# EasyEDA Pro project RP2040_AWG.eprj

# Schematic Schematic1
Board Name: Board1; Create Date: 2025-03-31; Page Name: P1; Project Name: PICO2040AWG; Schematic Name: Schematic1; Update Date: 2025-04-02; Company: 嘉立创EDA; Page Size: A4; Version: V1.0
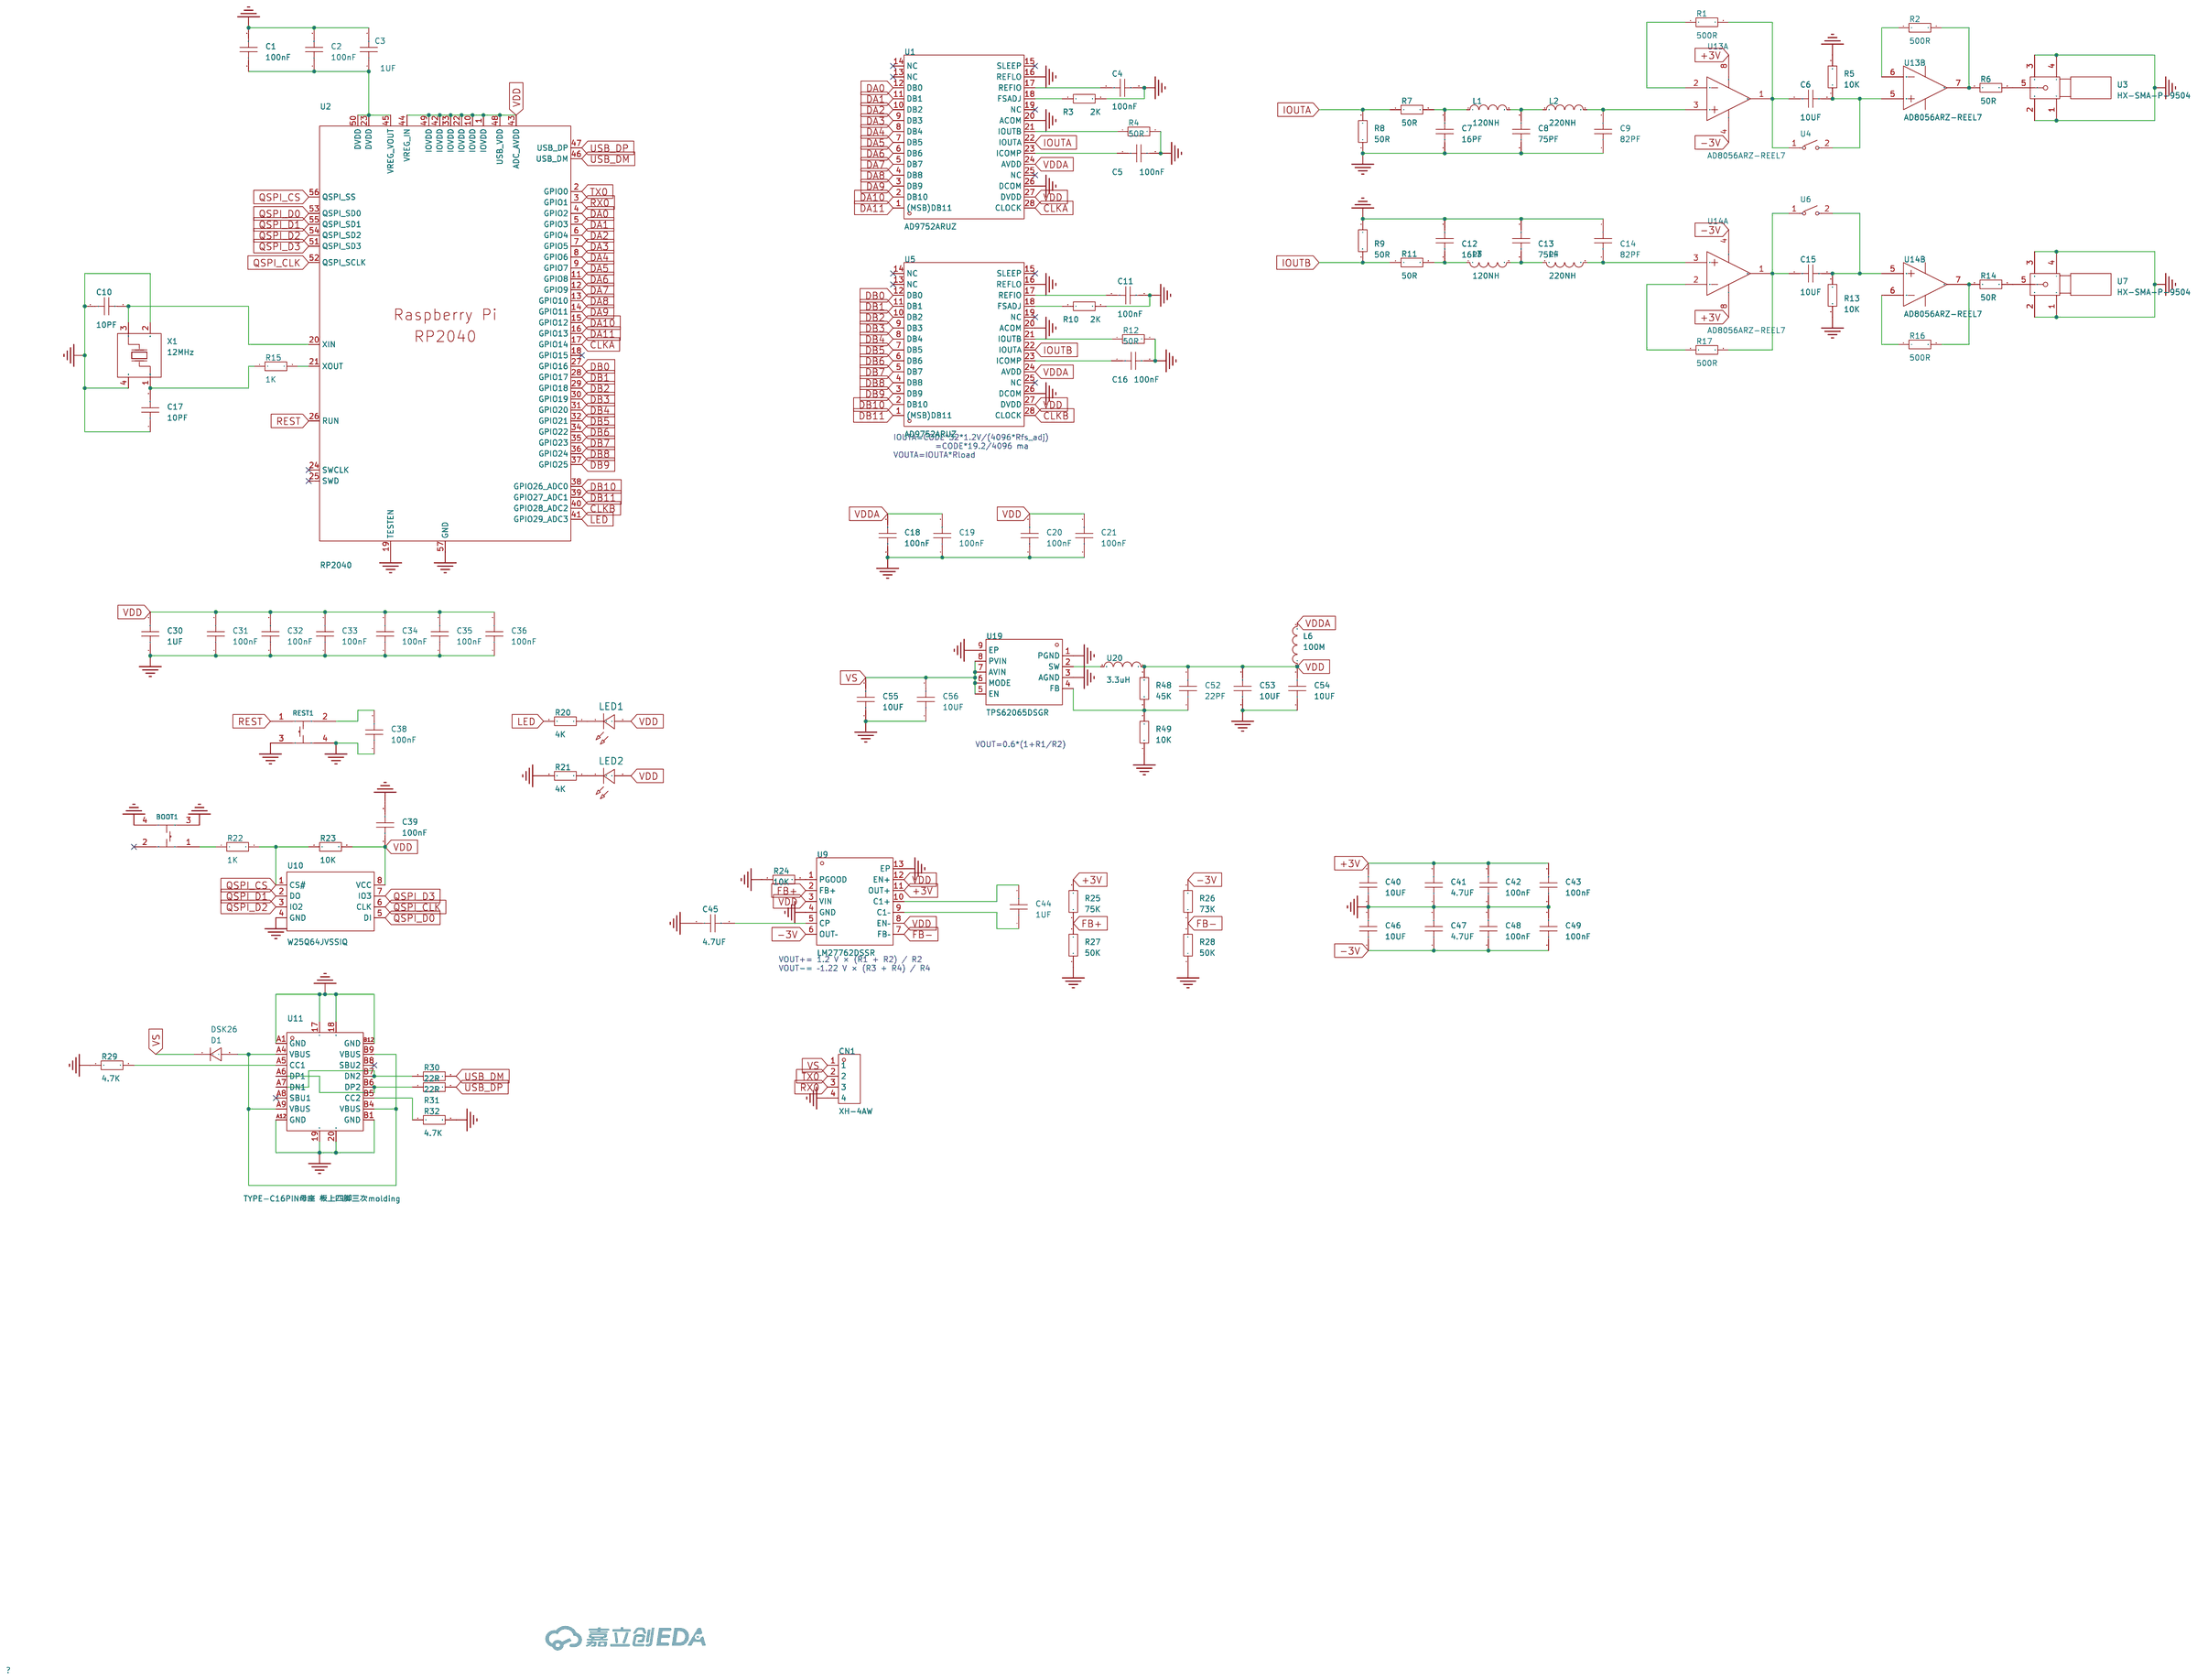
[diagram p0: schematic sheet]

## Parts
BOOT1  SKRPACE010  [KEY-SMD_4P-L4.2-W3.2-P2.20-LS4.6]
C1  100nF  [C0402_L]
C2  100nF  [C0402_L]
C3  1UF  [C0402_L]
C4  100nF  [C0402_L]
C5  100nF  [C0402_L]
C6  10UF  [C 0603_L]
C7  16PF  [C 0603_L]
C8  75PF  [C 0603_L]
C9  82PF  [C 0603_L]
C10  10PF  [C0402_L]
C11  100nF  [C0402_L]
C12  16PF  [C 0603_L]
C13  75PF  [C 0603_L]
C14  82PF  [C 0603_L]
C15  10UF  [C 0603_L]
C16  100nF  [C0402_L]
C17  10PF  [C0402_L]
C18  100nF  [C0402_L]
C19  100nF  [C0402_L]
C20  100nF  [C0402_L]
C21  100nF  [C0402_L]
C30  1UF  [C0402_L]
C31  100nF  [C0402_L]
C32  100nF  [C0402_L]
C33  100nF  [C0402_L]
C34  100nF  [C0402_L]
C35  100nF  [C0402_L]
C36  100nF  [C0402_L]
C38  100nF  [C0402_L]
C39  100nF  [C0402_L]
C40  10UF  [C0402_L]
C41  4.7UF  [C0402_L]
C42  100nF  [C0402_L]
C43  100nF  [C0402_L]
C44  1UF  [C0402_L]
C45  4.7UF  [C0402_L]
C46  10UF  [C0402_L]
C47  4.7UF  [C0402_L]
C48  100nF  [C0402_L]
C49  100nF  [C0402_L]
C52  22PF  [C0402_L]
C53  10UF  [C0402_L]
C54  10UF  [C0402_L]
C55  10UF  [C0402_L]
C56  10UF  [C0402_L]
CN1  XH-4AW  [CONN-TH_XH-4AW]
D1  DSK26  [SOD-123_L2.8-W1.8-LS3.7-RD]
L1  120NH  [L0603]
L2  220NH  [L0603]
L3  120NH  [L0603]
L4  220NH  [L0603]
L6  100M  [L0805]
LED1  -  [LED_0603]
LED2  -  [LED_0603]
R1  500R  [R0603_L]
R2  500R  [R0603_L]
R3  2K  [R0603_L]
R4  50R  [R0603_L]
R5  10K  [R0603_L]
R6  50R  [R0603_L]
R7  50R  [R0603_L]
R8  50R  [R0603_L]
R9  50R  [R0603_L]
R10  2K  [R0603_L]
R11  50R  [R0603_L]
R12  50R  [R0603_L]
R13  10K  [R0603_L]
R14  50R  [R0603_L]
R15  1K  [R0603_L]
R16  500R  [R0603_L]
R17  500R  [R0603_L]
R20  4K  [R0603_L]
R21  4K  [R0603_L]
R22  1K  [R0603_L]
R23  10K  [R0603_L]
R24  10K  [R0603_L]
R25  75K  [R0603_L]
R26  73K  [R0603_L]
R27  50K  [R0603_L]
R28  50K  [R0603_L]
R29  4.7K  [R0603_L]
R30  22R  [R0603_L]
R31  22R  [R0603_L]
R32  4.7K  [R0603_L]
R48  45K  [R0603_L]
R49  10K  [R0603_L]
REST1  SKRPACE010  [KEY-SMD_4P-L4.2-W3.2-P2.20-LS4.6]
U1  AD9752ARUZ  [TSSOP-28_L9.7-W4.4-P0.65-LS6.4-BL]
U2  RP2040  [LQFN-56_L7.0-W7.0-P0.4-EP]
U3  HX-SMA-P-9504  [RF-SMA-SMD_HX-SMA-P-9631]
U4  ZX-1.27BM-1PSMD  [SW-SMD_L5.4-W2.8-LS8.2]
U5  AD9752ARUZ  [TSSOP-28_L9.7-W4.4-P0.65-LS6.4-BL]
U6  ZX-1.27BM-1PSMD  [SW-SMD_L5.4-W2.8-LS8.2]
U7  HX-SMA-P-9504  [RF-SMA-SMD_HX-SMA-P-9631]
U9  LM27762DSSR  [WSON-12_L3.0-W2.0-P0.50-BL-EP]
U10  W25Q64JVSSIQ  [SOP-8_L5.3-W5.3-P1.27-LS8.0-BL]
U11  TYPE-C16PIN母座 板上四脚三次molding  [USB-SMD_TYPE-C16PIN]
U13  AD8056ARZ-REEL7  [SOP-8_L4.9-W3.9-P1.27-LS6.0-BL]  (sections 1,2)
U14  AD8056ARZ-REEL7  [SOP-8_L4.9-W3.9-P1.27-LS6.0-BL]  (sections 1,2)
U19  TPS62065DSGR  [WSON-8_L2.0-W2.0-P0.65-BL-EP]
U20  3.3uH  [IND-SMD_L2.5-W2.0]
X1  12MHz  [CRYSTAL-SMD_4P-L3.2-W2.5-BL]

## Library data of the parts
BOOT1 REST1 = SKRPACE010: 电路结构:单刀单掷;按钮形状:椭圆形按钮;安装方式:立贴;开关长度:4.2mm;开关宽度:3.2mm;开关高度:2.5mm;触点电流:50mA;额定电压(DC):16V;带灯:-;机械寿命:-;; LCSC Part Name: 4.2*3.2*2.5mm 立贴 轻触开关; Supplier Part: C139797; Manufacturer: ALPSALPINE(阿尔卑斯阿尔派); Supplier Footprint: SMD; JLCPCB Part Class: 扩展库; Datasheet: https://atta.szlcsc.com/upload/public/pdf/source/20171113/C139797_15105612676371115729.pdf; Supplier: LCSC; Circuit: 单刀单掷; Actuator Style: 椭圆形按钮; Mounting Style: 立贴; Switch Length: 4.2mm; Switch Width: 3.2mm; Switch Height: 2.5mm; Contact Current: 50mA; Voltage Rating (DC): 16V
C1-C5 C10 C11 C16-C21 C30-C36 C38 C39 C52-C56 = C0402_L: Supplier Footprint: 0402
C6-C9 C12-C15 = C0603_L
C40-C49 = CAP_0402: Supplier Footprint: 0402
CN1 = XH-4AW: LCSC Part Name: 1x4P 间距:2.54mm 弯插 系列:XH; Supplier Part: C2908613; Manufacturer: HCTL(华灿天禄); Supplier Footprint: 弯插,P=2.5mm; JLCPCB Part Class: 扩展库; Datasheet: https://atta.szlcsc.com/upload/public/pdf/source/20230711/B565BAF3B11666EF6B81B3605408F2BD.pdf; Supplier: LCSC; Pins Structure: 1x4P; Pitch: 2.54mm; Mounting Style: 弯插; Reference Series: XH; Number of Pins: 4P; Number of Rows: 1; Number of PINs Per Row: 4; Current Rating (Max): 3A; Contact Material: 黄铜; Contact Plating: 锡; Operating Temperature Range: -25℃~+85℃
D1 = DSK26_C50553: 二极管配置:独立式;正向压降(Vf):700mV@2A;直流反向耐压(Vr):60V;整流电流:2A;; LCSC Part Name: 电压:60V 电流:2A; Supplier Part: C50553; Manufacturer: MDD(辰达半导体); Supplier Footprint: SOD-123FL; JLCPCB Part Class: 扩展库; Datasheet: https://atta.szlcsc.com/upload/public/pdf/source/20230823/D3EA44505E795B66956504010A0876FD.pdf; Supplier: LCSC; Diode Configuration: 独立式; Forward Voltage (Vf@If): 700mV@2A; Reverse Voltage (Vr): 60V; Rectified Current: 2A; Reverse Leakage Current (Ir): 500uA@60V
L1-L4 = L_0603
L6 = L_0805
LED1 LED2 = LED_0603-R: Supplier Footprint: 0603
R1-R17 R20-R32 R48 R49 = R0603_L
U1 U5 = AD9752ARUZ: LCSC Part Name: AD9752 12bit 125 MSPS 高性能数模转换器; Supplier Part: C653784; Manufacturer: ADI(亚德诺); Supplier Footprint: TSSOP-28; JLCPCB Part Class: 扩展库; Datasheet: https://atta.szlcsc.com/upload/public/pdf/source/20220519/126854C680F6FAD03FB5EB9A72D33697.pdf; Supplier: LCSC; Resolution: 12位; Interface: 并行; Supply Voltage: 2.7V~5.5V; Settling Time: 35ns; Output Type: 电流-非缓冲; Integral nonlinearity: 0.5LSB；0.25LSB; Operating Temperature: -40℃~+85℃
U2 = RP2040_C2040: LCSC Part Name: RP2040（RP2B2）; Supplier Part: C2040; Manufacturer: Raspberry Pi(树莓派); Supplier Footprint: LQFN-56(7x7); JLCPCB Part Class: 扩展库; Datasheet: https://atta.szlcsc.com/upload/public/pdf/source/20210621/C2040_96F425825606B7957D87DD32E2512CA9.pdf; Supplier: LCSC; CPU Maximum Speed: 133MHz; Number of I/O: 30; ADC (Bit): 12bit
U3 U7 = HX-SMA-P-9504: LCSC Part Name: RF同轴连接器; Supplier Part: C5124055; Manufacturer: 环协; Supplier Footprint: 插件; JLCPCB Part Class: 扩展库; Datasheet: https://atta.szlcsc.com/upload/public/pdf/source/20220818/A2BD27A0805D12010C71D7D184768F5F.pdf; Supplier: LCSC
U4 U6 = ZX-1.27BM-1PSMD: 类型:平拨,凹槽式;电路结构:单刀单掷;开关位数:1位;额定电流:25mA;额定电压:24V;使用寿命:1千次;颜色:黑色;; LCSC Part Name: 1.27间距 S脚 贴片1位编带 平拨 凹槽式 1位拨码开关; Supplier Part: C7527751; Manufacturer: Megastar(兆星); Supplier Footprint: SMD; JLCPCB Part Class: 扩展库; Datasheet: https://atta.szlcsc.com/upload/public/pdf/source/20230821/CEAB8B442A6A36B2EC03530A42E8CA85.pdf; Supplier: LCSC; Type: 平拨,凹槽式; Circuit: 单刀单掷; Number of Positions: 1位; Pin Style: 焊片; Lead Pitch: 1.27mm; Current Rating: 25mA; Voltage Rating: 24V; Operating Temperature: -30℃~+85℃; Operating Life: 1千次; Color: 黑色
U9 = LM27762DSSR: LM27762 带有集成 LDO 的低噪声正负输出电荷泵; Supplier Part: C473398; Manufacturer: TI(德州仪器); Supplier Footprint: WSON-12-EP(2x3); JLCPCB Part Class: 扩展库; Datasheet: https://www.ti.com/cn/lit/gpn/lm27762; Supplier: LCSC
U10 = W25Q64JVSSIQ_C83140: Supplier Part: C83140; Manufacturer: WINBOND(华邦); Supplier Footprint: SOP-8-208mil; JLCPCB Part Class: 扩展库; Datasheet: https://atta.szlcsc.com/upload/public/pdf/source/20161110/1478742546019.pdf; Supplier: LCSC
U11 = TYPE-C16PIN母座 板上四脚三次molding: Supplier Part: C9900000202; Supplier Footprint: TYPE-C16PIN; JLCPCB Part Class: 扩展库; Supplier: LCSC
U13 U14 = AD8056ARZ-REEL7: LCSC Part Name: 低功耗，300 MHz电压反馈放大器; Supplier Part: C495041; Manufacturer: ADI(亚德诺); Supplier Footprint: SOP-8; JLCPCB Part Class: 扩展库; Datasheet: https://atta.szlcsc.com/upload/public/pdf/source/20200312/C495041_C16AA6A221C180405C406EE14BB2BBAE.pdf; Supplier: LCSC; Number of Circuits: 双路; Maximum Power Supply Range (Vdd-Vss): 12V; Voltage - Input Offset(Vos): 5mV; Input Offset Voltage Drift (Vos TC): 6uV/℃; Slew Rate(SR): 1400V/us; Current - Input Bias(Ib): 400nA; Noise density(eN): 6nV/√Hz@100kHz; Common Mode Rejection Ratio (CMRR): 82dB; Output Current: 60mA; Operating Temperature: -40℃~+125℃
U19 = TPS62065DSGR: 功能类型:降压型;输出类型:可调;输入电压:2.9V~6V;输出电压:800mV~6V;输出电流(最大值):2A;; Supplier Part: C398352; Manufacturer: TI(德州仪器); Supplier Footprint: WSON-8-EP(2x2); JLCPCB Part Class: 扩展库; Datasheet: https://www.ti.com/cn/lit/gpn/tps62065; Supplier: LCSC; Function: 降压型; Output Type: 可调; Input Voltage: 2.9V~6V; Output Voltage: 800mV~6V; Output Current (Max): 2A; Switching Frequency: 3MHz; Operating Temperature: -40℃~+85℃@(TA); Synchronous Rectification: 是; Number of Outputs: 1; Topology: 降压式; Switch tube (built-in/external): 内置
U20 = SMMS252010-3R3M: 电感值:3.3uH;精度:±20%;饱和电流(Isat):2.5A;类型:一体成型电感;; LCSC Part Name: 3.3uH ±20% 2.5A; Supplier Part: C5161636; Manufacturer: SXN(顺翔诺); Supplier Footprint: SMD,2x2.5mm; JLCPCB Part Class: 扩展库; Datasheet: https://atta.szlcsc.com/upload/public/pdf/source/20220915/1B56D3CEE5BC15077D1615000298C9B6.pdf; Supplier: LCSC; Tolerance: ±20%; Saturation Current (Isat): 2.5A; DC Resistance (DCR): 100mΩ; Type: 一体成型电感
X1 = X322512MSB4SI: LCSC Part Name: 12MHz ±10ppm 20pF; Supplier Part: C9002; Manufacturer: YXC(扬兴晶振); Supplier Footprint: SMD3225-4P; JLCPCB Part Class: 基础库; Datasheet: https://atta.szlcsc.com/upload/public/pdf/source/20240329/19D5F850207469550BEB00D7DFEDBC7A.pdf; Supplier: LCSC; Crystal Type: 贴片晶振; Normal temperature Frequency Tolerance: ±10ppm; External load capacitor: 20pF; Frequency Stability(Full temperature range): ±20ppm; Operating Temperature: -40℃~+85℃

## Nets
+3V: C40.2 C41.2 C42.2 C43.2 R25.2 U9.11(OUT+) U13.8(+VS) U14.8(+VS)
-3V: C46.1 C47.1 C48.1 C49.1 R26.2 U9.6(OUT–) U13.4(-VS) U14.4(-VS)
GND: BOOT1.3 BOOT1.4 C1.2 C2.2 C3.2 C4.2 C5.2 C7.1 C8.1 C9.1 C10.1 C11.2 C12.1 C13.1 C14.1 C16.2 C17.1 C18.1 C19.1 C20.1 C21.1 C30.1 C31.1 C32.1 C33.1 C34.1 C35.1 C36.1 C38.1 C39.2 C40.1 C41.1 C42.1 C43.1 C45.1 C46.2 C47.2 C48.2 C49.2 C53.1 C54.1 C55.1 C56.1 CN1.4 R3.2 R4.2 R5.2 R8.1 R9.1 R10.2 R12.2 R13.2 R21.2 R24.1 R27.1 R28.1 R29.1 R32.2 R49.1 REST1.3 REST1.4 U1.16(REFLO) U1.20(ACOM) U1.26(DCOM) U2.19(TESTEN) U2.57(GND) U3.1 U3.2 U3.3 U3.4 U5.16(REFLO) U5.20(ACOM) U5.26(DCOM) U7.1 U7.2 U7.3 U7.4 U9.4(GND) U9.13(EP) U10.4(GND) U11.17 U11.18 U11.19 U11.20 U11.A1(GND) U11.A12(GND) U11.B1(GND) U11.B12(GND) U19.1(PGND) U19.3(AGND) U19.9(EP) X1.2(GND) X1.4(GND)
VDD: C20.2 C21.2 C30.2 C31.2 C32.2 C33.2 C34.2 C35.2 C36.2 C39.1 C52.2 C53.2 C54.2 L6.1 LED1.2(A) LED2.2(A) R23.2 R48.2 U1.27(DVDD) U2.1(IOVDD) U2.10(IOVDD) U2.22(IOVDD) U2.33(IOVDD) U2.42(IOVDD) U2.43(ADC_AVDD) U2.44(VREG_IN) U2.48(USB_VDD) U2.49(IOVDD) U5.27(DVDD) U9.3(VIN) U9.8(EN–) U9.12(EN+) U10.8(VCC) U20.1
VDDA: C18.2 C19.2 L6.2 U1.24(AVDD) U5.24(AVDD)
CLKA: U1.28(CLOCK) U2.17(GPIO14)
CLKB: U2.40(GPIO28_ADC2) U5.28(CLOCK)
DA0: U1.12(DB0) U2.4(GPIO2)
DA1: U1.11(DB1) U2.5(GPIO3)
DA2: U1.10(DB2) U2.6(GPIO4)
DA3: U1.9(DB3) U2.7(GPIO5)
DA4: U1.8(DB4) U2.8(GPIO6)
DA5: U1.7(DB5) U2.9(GPIO7)
DA6: U1.6(DB6) U2.11(GPIO8)
DA7: U1.5(DB7) U2.12(GPIO9)
DA8: U1.4(DB8) U2.13(GPIO10)
DA9: U1.3(DB9) U2.14(GPIO11)
DA10: U1.2(DB10) U2.15(GPIO12)
DA11: U1.1((MSB)DB11) U2.16(GPIO13)
DB0: U2.27(GPIO16) U5.12(DB0)
DB1: U2.28(GPIO17) U5.11(DB1)
DB2: U2.29(GPIO18) U5.10(DB2)
DB3: U2.30(GPIO19) U5.9(DB3)
DB4: U2.31(GPIO20) U5.8(DB4)
DB5: U2.32(GPIO21) U5.7(DB5)
DB6: U2.34(GPIO22) U5.6(DB6)
DB7: U2.35(GPIO23) U5.5(DB7)
DB8: U2.36(GPIO24) U5.4(DB8)
DB9: U2.37(GPIO25) U5.3(DB9)
DB10: U2.38(GPIO26_ADC0) U5.2(DB10)
DB11: U2.39(GPIO27_ADC1) U5.1((MSB)DB11)
FB+: R25.1 R27.2 U9.2(FB+)
FB-: R26.1 R28.2 U9.7(FB–)
IOUTA: R7.1 R8.2 U1.22(IOUTA)
IOUTB: R9.2 R11.1 U5.22(IOUTA)
LED: R20.2 U2.41(GPIO29_ADC3)
QSPI_CLK: U2.52(QSPI_SCLK) U10.6(CLK)
QSPI_CS: R22.2 R23.1 U2.56(QSPI_SS) U10.1(CS#)
QSPI_D0: U2.53(QSPI_SD0) U10.5(DI)
QSPI_D1: U2.55(QSPI_SD1) U10.2(DO)
QSPI_D2: U2.54(QSPI_SD2) U10.3(IO2)
QSPI_D3: U2.51(QSPI_SD3) U10.7(IO3)
REST: REST1.1 U2.26(RUN)
RX0: CN1.3 U2.3(GPIO1)
TX0: CN1.2 U2.2(GPIO0)
USB_DM: R30.2 U2.46(USB_DM)
USB_DP: R31.2 U2.47(USB_DP)
VS: C55.2 C56.2 CN1.1 D1.1(K) U19.5(EN) U19.6(MODE) U19.7(AVIN) U19.8(PVIN)
$1N1216: D1.2(A) U11.A4(VBUS) U11.A9(VBUS) U11.B4(VBUS) U11.B9(VBUS)
$1N1218: R31.1 U11.A6(DP1) U11.B6(DP2)
$1N1219: R30.1 U11.A7(DN1) U11.B7(DN2)
$1N1223: R29.2 U11.A5(CC1)
$1N1225: R32.1 U11.B5(CC2)
$1N4540: C5.1 U1.23(ICOMP)
$1N4544: C16.1 U5.23(ICOMP)
$1N4675: R4.1 U1.21(IOUTB)
$1N4699: R12.1 U5.21(IOUTB)
$1N4854: R10.1 U5.18(FSADJ)
$1N4906: C11.1 U5.17(REFIO)
$1N4979: R3.1 U1.18(FSADJ)
$1N5031: C4.1 U1.17(REFIO)
$1N6731: C45.2 U9.5(CP)
$1N6733: C44.2 U9.10(C1+)
$1N6734: C44.1 U9.9(C1–)
$1N6742: R24.2 U9.1(PGOOD)
$1N10979: R1.1 U13.2(-IN 1)
$1N10982: C6.1 R1.2 U4.1 U13.1(OUT 1)
$1N11756: C7.2 L1.1 R7.2
$1N11780: C8.2 L1.2 L2.1
$1N11804: C9.2 L2.2 U13.3(+IN 1)
$1N12227: C6.2 R5.1 U4.2 U13.5(+IN 2)
$1N12347: R2.1 U13.6(-IN 2)
$1N12352: R2.2 R6.1 U13.7(OUT 2)
$1N12806: R17.1 U14.2(-IN 1)
$1N12814: C12.2 L3.1 R11.2
$1N12817: C13.2 L3.2 L4.1
$1N12820: C14.2 L4.2 U14.3(+IN 1)
$1N12835: R16.1 U14.6(-IN 2)
$1N12838: R14.1 R16.2 U14.7(OUT 2)
$1N19487: BOOT1.1 R22.1
$1N19944: U19.2(SW) U20.2
$1N19945: C52.1 R48.1 R49.2 U19.4(FB)
Net-(C1-1): C1.1 C2.1 C3.1 U2.23(DVDD) U2.45(VREG_VOUT) U2.50(DVDD)
Net-(C10-2): C10.2 U2.20(XIN) X1.3(OSC2)
Net-(C15-1): C15.1 R17.2 U6.1 U14.1(OUT 1)
Net-(C15-2): C15.2 R13.1 U6.2 U14.5(+IN 2)
Net-(C17-2): C17.2 R15.1 X1.1(OSC1)
Net-(C38-2): C38.2 REST1.2
Net-(LED1-1): LED1.1(C) R20.1
Net-(LED2-1): LED2.1(C) R21.1
Net-(R6-2): R6.2 U3.5
Net-(R14-2): R14.2 U7.5
Net-(R15-2): R15.2 U2.21(XOUT)

Not connected (* = marked no-connect by the designer): BOOT1 2*; U1 13(NC)* 14(NC)* 15(SLEEP)* 19(NC)* 25(NC)*; U2 18(GPIO15)* 24(SWCLK)* 25(SWD)*; U5 13(NC)* 14(NC)* 15(SLEEP)* 19(NC)* 25(NC)*; U11 A8(SBU1)* B8(SBU2)*

## Notes on the sheet
- IOUTA=CODE*32*1.2V/(4096*Rfs_adj)
            =CODE*19.2/4096 ma
  VOUTA=IOUTA*Rload
- VOUT=0.6*(1+R1/R2)
- VOUT+= 1.2 V × (R1 + R2) / R2
  VOUT-= –1.22 V × (R3 + R4) / R4

# Board PCB1
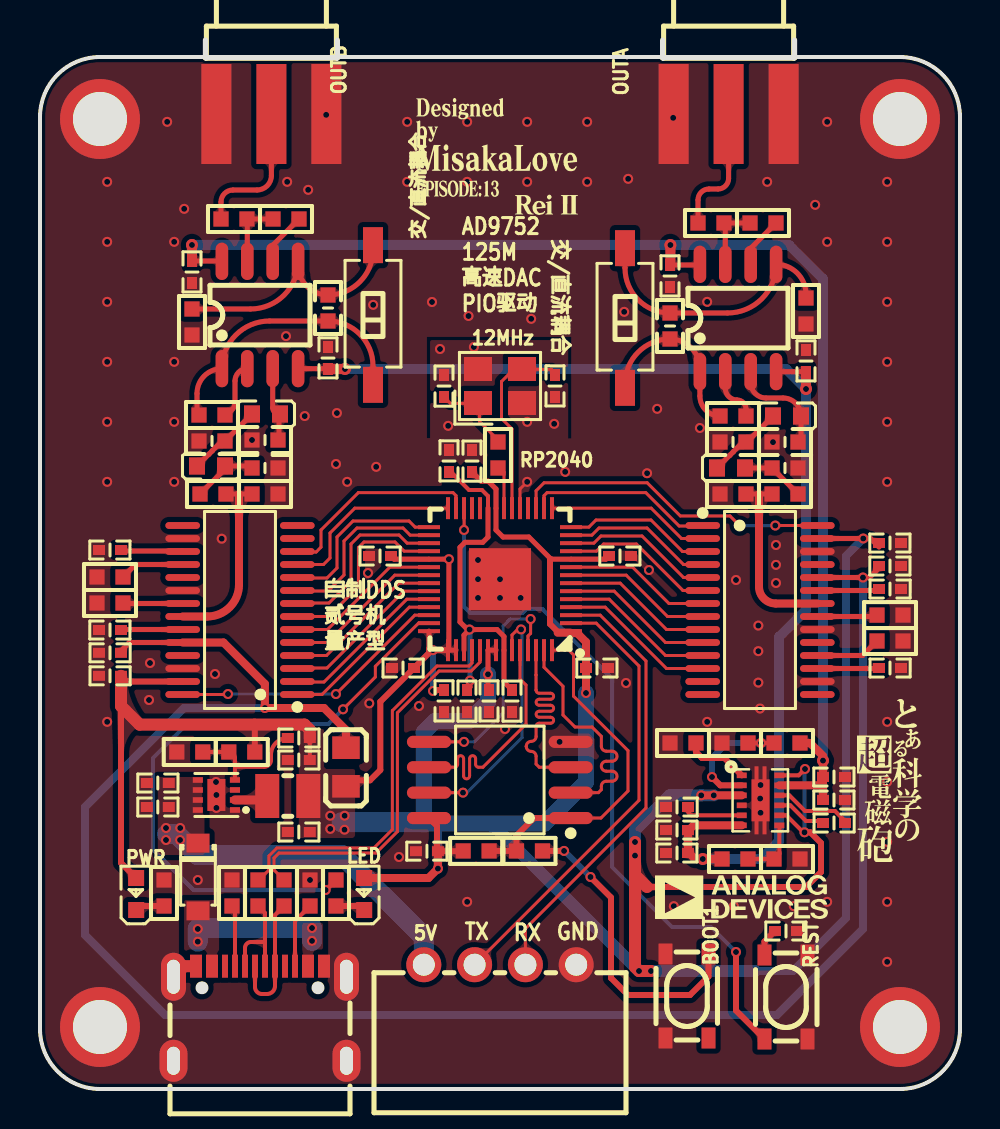
[diagram p1: board, top side]
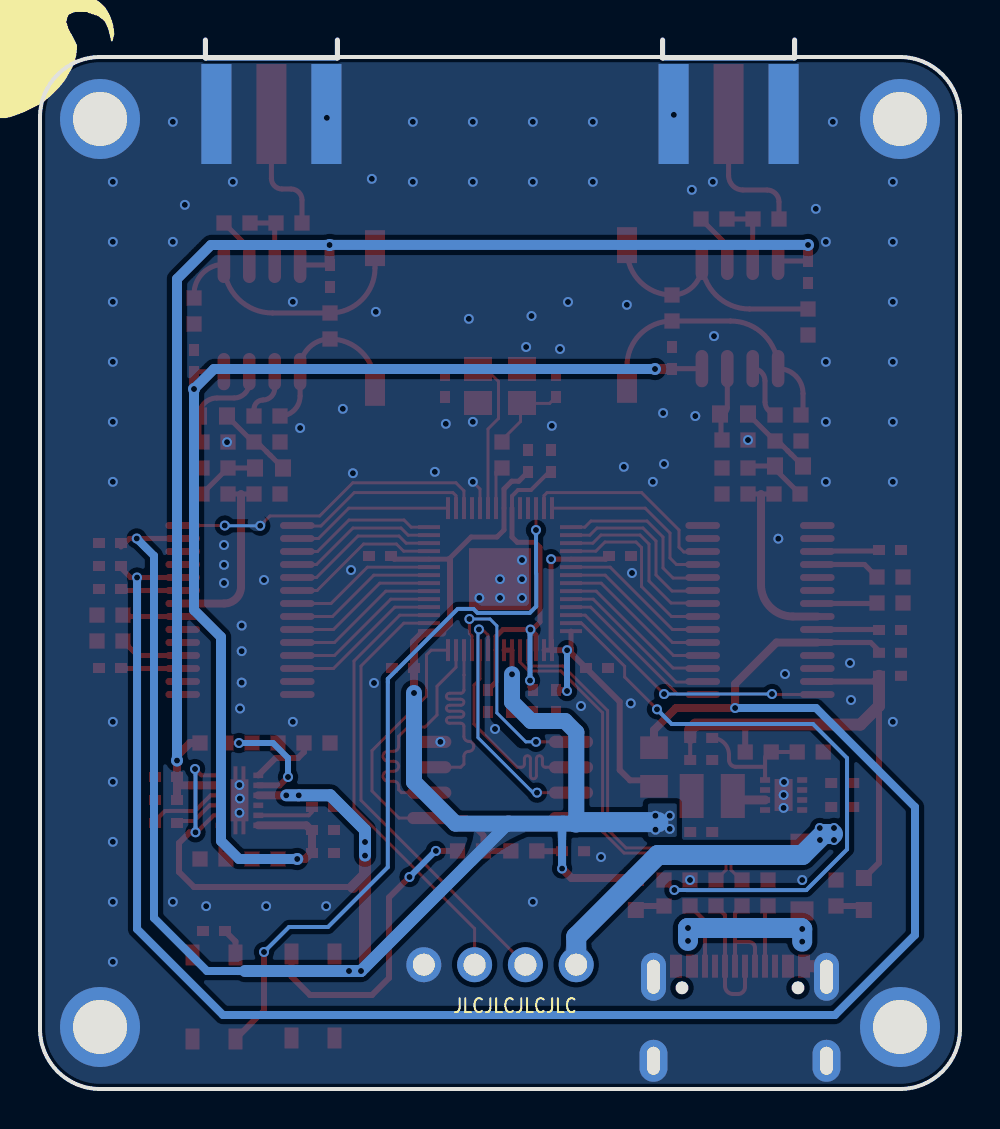
[diagram p2: board, bottom side, seen from below]

Outline 46 x 52.45 mm; copper layers: Top Layer, Bottom Layer. Coordinates in mm from the lower left corner of the outline.
Outline path: 0,48.6 0,3 arc(0.88,0.88) 3,0 43,0 arc(45.12,0.88) 46,3 46,48.6 arc(45.12,50.72) 43,51.6 3,51.6 arc(0.88,50.72) 0,48.6
Stack: Top Layer 0.035mm / Dielectric1 1.51mm FR4 er 4.5 / Bottom Layer 0.035mm

## Design rules (mm)
template: 自定义配置
spacing copperThickness1oz (default): track to track 0.102, other pairs 0.12 to 0.3
spacing copperThickness2oz: track to track 0.203, other pairs 0.152 to 0.3
track width copperThickness1oz (default): min 0.127, default 0.254, max 2.54
track width copperThickness2oz: min 0.203, default 0.254, max 2.54
differential pair differentialPair (default): width min 0.127, default 0.254, max 2.54; gap min 0.152, default 0.152
via viaSize (default): diameter min 0.5, default 0.61, max 10; hole min 0.3, default 0.305, max 6.3

## Placement (name value [footprint] x y rotation side)
5V  XH-4AW  [CONN-TH_XH-4AW]  23 6.21 0 top
12MHz  12MHz  [CRYSTAL-SMD_4P-L3.2-W2.5-BL]  23 35.15 0 top
BOOT1  SKRPACE010  [KEY-SMD_4P-L4.2-W3.2-P2.20-LS4.6]  32.35 4.65 270 top
C1  100nF  [C0402_L]  20.45 31.4 90 top
C2  100nF  [C0402_L]  23.6 19.4 270 top
C3  1UF  [C0402_L]  21.35 19.4 270 top
C4  100nF  [C0402_L]  42.5 21.05 0 top
C5  100nF  [C0402_L]  42.5 25 0 top
C6  10UF  [C 0603_L]  31.5 38.15 90 top
C7  16PF  [C 0603_L]  37.25 31.05 180 top
C8  75PF  [C 0603_L]  34.65 32.35 0 top
C9  82PF  [C 0603_L]  37.25 32.35 0 top
C10  10PF  [C0402_L]  25.75 35.15 90 top
C11  100nF  [C0402_L]  3.5 26.95 180 top
C12  16PF  [C 0603_L]  11.25 31.05 180 top
C13  75PF  [C 0603_L]  8.6 32.4 0 top
C14  82PF  [C 0603_L]  11.25 32.45 0 top
C15  10UF  [C 0603_L]  14.4 39.05 90 top
C16  100nF  [C0402_L]  3.5 22.95 180 top
C17  10PF  [C0402_L]  20.2 35.15 270 top
C18  100nF  [C0402_L]  3.5 21.81 0 top
C19  100nF  [C0402_L]  42.5 26.15 180 top
C20  100nF  [C0402_L]  3.5 20.66 0 top
C21  100nF  [C0402_L]  42.5 27.3 180 top
C30  1UF  [C0402_L]  20.2 19.4 90 top
C31  100nF  [C0402_L]  22.45 19.4 90 top
C32  100nF  [C0402_L]  18.15 21.05 0 top
C33  100nF  [C0402_L]  21.6 31.4 270 top
C34  100nF  [C0402_L]  17 26.65 0 top
C35  100nF  [C0402_L]  27.85 21.05 180 top
C36  100nF  [C0402_L]  29 26.65 180 top
C38  100nF  [C0402_L]  37.3 7.9 180 top
C39  100nF  [C0402_L]  19.35 11.89 180 top
C40  10UF  [C0402_L]  39.7 14.45 180 top
C41  4.7UF  [C0402_L]  39.7 15.6 180 top
C42  100nF  [C0402_L]  31.5 40.65 90 top
C43  100nF  [C0402_L]  7.6 40.85 90 top
C44  1UF  [C0402_L]  39.7 13.3 0 top
C45  4.7UF  [C0402_L]  31.85 14.1 0 top
C46  10UF  [C0402_L]  31.85 11.8 180 top
C47  4.7UF  [C0402_L]  31.85 12.95 180 top
C48  100nF  [C0402_L]  38.3 36.4 90 top
C49  100nF  [C0402_L]  14.4 36.55 90 top
C52  22PF  [C0402_L]  12.94 17.55 0 top
C53  10UF  [C0402_L]  12.94 12.85 0 top
C54  10UF  [C0402_L]  12.94 16.45 0 top
C55  10UF  [C0402_L]  5.89 14.1 0 top
C56  10UF  [C0402_L]  5.89 15.3 0 top
D1  DSK26  [SOD-123_L2.8-W1.8-LS3.7-RD]  7.9 10.6 270 top
L1  120NH  [L0603]  34.55 31.05 180 top
L2  220NH  [L0603]  37.35 33.65 0 top
L3  120NH  [L0603]  8.55 31.15 180 top
L4  220NH  [L0603]  11.3 33.75 0 top
L6  100M  [L0805]  15.3 16.1 90 top
LED  -  [LED_0603]  16.2 9.8 90 top
NOREF  -  [Pad_e104]  3 3.1 0 top
NOREF#2  -  [Pad_e14]  43 3.1 0 top
NOREF#3  -  [Pad_e108]  43 48.5 0 top
NOREF#4  -  [Pad_e107]  3 48.5 0 top
OUTA  HX-SMA-P-9504  [RF-SMA-SMD_HX-SMA-P-9631]  34.43 48.75 180 top
OUTB  HX-SMA-P-9504  [RF-SMA-SMD_HX-SMA-P-9631]  11.57 48.75 180 top
PWR  -  [LED_0603]  4.8 9.8 90 top
R1  500R  [R0603_L]  34.65 33.65 180 top
R2  500R  [R0603_L]  36.15 43.3 180 top
R3  2K  [R0603_L]  42.5 22.4 0 top
R4  50R  [R0603_L]  42.5 23.7 0 top
R5  10K  [R0603_L]  38.3 38.9 270 top
R6  50R  [R0603_L]  33.55 43.3 180 top
R7  50R  [R0603_L]  37.25 29.75 0 top
R8  50R  [R0603_L]  34.65 29.75 0 top
R9  50R  [R0603_L]  11.25 29.75 180 top
R10  2K  [R0603_L]  3.5 25.6 180 top
R11  50R  [R0603_L]  8.65 29.75 180 top
R12  50R  [R0603_L]  3.5 24.3 180 top
R13  10K  [R0603_L]  7.6 38.35 270 top
R14  50R  [R0603_L]  9.7 43.5 180 top
R15  1K  [R0603_L]  22.9 31.7 270 top
R16  500R  [R0603_L]  12.3 43.5 180 top
R17  500R  [R0603_L]  8.6 33.7 180 top
R20  4K  [R0603_L]  14.8 9.8 90 top
R21  4K  [R0603_L]  6.2 9.8 90 top
R22  1K  [R0603_L]  24.47 11.9 180 top
R23  10K  [R0603_L]  21.81 11.9 180 top
R24  10K  [R0603_L]  32.15 17.3 0 top
R25  75K  [R0603_L]  37.35 17.3 0 top
R26  73K  [R0603_L]  34.75 11.5 180 top
R27  50K  [R0603_L]  34.75 17.3 0 top
R28  50K  [R0603_L]  37.35 11.5 180 top
R29  4.7K  [R0603_L]  9.6 9.8 270 top
R30  22R  [R0603_L]  10.9 9.8 90 top
R31  22R  [R0603_L]  12.2 9.8 90 top
R32  4.7K  [R0603_L]  13.5 9.8 90 top
R48  45K  [R0603_L]  10.09 16.85 0 top
R49  10K  [R0603_L]  7.49 16.85 0 top
REST  SKRPACE010  [KEY-SMD_4P-L4.2-W3.2-P2.20-LS4.6]  37.3 4.6 90 top
RP2040  RP2040  [LQFN-56_L7.0-W7.0-P0.4-EP]  23 25.49 180 top
U1  AD9752ARUZ  [TSSOP-28_L9.7-W4.4-P0.65-LS6.4-BL]  36 23.95 270 top
U4  ZX-1.27BM-1PSMD  [SW-SMD_L5.4-W2.8-LS8.2]  29.25 38.55 0 top
U5  AD9752ARUZ  [TSSOP-28_L9.7-W4.4-P0.65-LS6.4-BL]  10 23.95 90 top
U9  LM27762DSSR  [WSON-12_L3.0-W2.0-P0.50-BL-EP]  36.03 14.43 270 top
U10  W25Q64JVSSIQ  [SOP-8_L5.3-W5.3-P1.27-LS8.0-BL]  22.99 15.45 90 top
U11  TYPE-C16PIN母座 板上四脚三次molding  [USB-SMD_TYPE-C16PIN]  11 3.78 0 top
U13  AD8056ARZ-REEL7  [SOP-8_L4.9-W3.9-P1.27-LS6.0-BL]  34.9 38.55 0 top
U14  AD8056ARZ-REEL7  [SOP-8_L4.9-W3.9-P1.27-LS6.0-BL]  11 38.7 0 top
U19  TPS62065DSGR  [WSON-8_L2.0-W2.0-P0.65-BL-EP]  8.82 14.7 90 top
U20  3.3uH  [IND-SMD_L2.5-W2.0]  12.39 14.65 0 top
交/直流耦合  ZX-1.27BM-1PSMD  [SW-SMD_L5.4-W2.8-LS8.2]  16.65 38.7 0 top

## Footprints (pads in the part's own frame, mm; a bottom-side part is the same pattern mirrored in y, then rotated)
C0402_L
  rect 0.6x0.5 smd: 1(-0.55,0) 2(0.55,0)
C 0603_L
  rect 0.762x0.762 smd: 1(-0.65,0) 2(0.65,0)
CONN-TH_XH-4AW
  round 1.75 hole 1.1: 1(-3.81,0) 2(-1.27,0) 3(1.27,0) 4(3.81,0)
CRYSTAL-SMD_4P-L3.2-W2.5-BL
  rect 1.4x1.2 smd: 1(-1.1,-0.85) 2(1.1,-0.85) 3(1.1,0.85) 4(-1.1,0.85)
IND-SMD_L2.5-W2.0
  rect 1.2x2.2 smd: 1(1.028,0) 2(-1.028,0)
KEY-SMD_4P-L4.2-W3.2-P2.20-LS4.6
  rect 1.05x0.7 smd: 1(-2.1,1.075) 2(2.1,1.075) 3(-2.1,-1.075) 4(2.1,-1.075)
L0603
  rect 0.8x0.864 smd: 1(-0.7,0) 2(0.7,0)
L0805
  rect 1.133x1.377 smd: 1(-0.966,0) 2(0.966,0)
LED_0603
  rect 0.8x0.8 smd: 1(-0.851,-0.01) 2(0.75,-0.005)
LQFN-56_L7.0-W7.0-P0.4-EP
  rect 1.1x0.2 smd: 1(-3.55,2.6) 2(-3.55,2.2) 3(-3.55,1.8) 4(-3.55,1.4) 5(-3.55,1) 6(-3.55,0.6) 7(-3.55,0.2) 8(-3.55,-0.2) 9(-3.55,-0.6) 10(-3.55,-1) 11(-3.55,-1.4) 12(-3.55,-1.8) 13(-3.55,-2.2) 14(-3.55,-2.6) 29(3.55,-2.6) 30(3.55,-2.2) 31(3.55,-1.8) 32(3.55,-1.4) 33(3.55,-1) 34(3.55,-0.6) 35(3.55,-0.2) 36(3.55,0.2) 37(3.55,0.6) 38(3.55,1) 39(3.55,1.4) 40(3.55,1.8) 41(3.55,2.2) 42(3.55,2.6)
  rect 0.2x1.1 smd: 15(-2.6,-3.55) 16(-2.2,-3.55) 17(-1.8,-3.55) 18(-1.4,-3.55) 19(-1,-3.55) 20(-0.6,-3.55) 21(-0.2,-3.55) 22(0.2,-3.55) 23(0.6,-3.55) 24(1,-3.55) 25(1.4,-3.55) 26(1.8,-3.55) 27(2.2,-3.55) 28(2.6,-3.55) 43(2.6,3.55) 44(2.2,3.55) 45(1.8,3.55) 46(1.4,3.55) 47(1,3.55) 48(0.6,3.55) 49(0.2,3.55) 50(-0.2,3.55) 51(-0.6,3.55) 52(-1,3.55) 53(-1.4,3.55) 54(-1.8,3.55) 55(-2.2,3.55) 56(-2.6,3.55)
  rect 3.1x3.1 smd: 57(0,0)
Pad_e14
  round 4 hole 2.7: 1(0,0)
Pad_e104
  round 4 hole 2.7: 1(0,0)
Pad_e107
  round 4 hole 2.7: 1(0,0)
Pad_e108
  round 4 hole 2.7: 1(0,0)
R0603_L
  rect 0.762x0.762 smd: 1(-0.65,0) 2(0.65,0)
RF-SMA-SMD_HX-SMA-P-9631
  rect 1.5x5 smd: 1(-2.75,0) 2(2.75,0) 5(0,0)
  rect 1.5x5 smd far side: 3(-2.75,0) 4(2.75,0)
SOD-123_L2.8-W1.8-LS3.7-RD
  rect 0.95x1.15 smd: 1(-1.692,0) 2(1.692,0)
SOP-8_L4.9-W3.9-P1.27-LS6.0-BL
  oval 0.63x1.865 smd: 1(-1.905,-2.683) 2(-0.635,-2.683) 3(0.635,-2.683) 4(1.905,-2.683) 5(1.905,2.683) 6(0.635,2.683) 7(-0.635,2.683) 8(-1.905,2.683)
SOP-8_L5.3-W5.3-P1.27-LS8.0-BL
  oval 0.609x2.204 smd: 1(-1.905,-3.542) 2(-0.635,-3.542) 3(0.635,-3.542) 4(1.905,-3.542) 5(1.905,3.542) 6(0.635,3.542) 7(-0.635,3.542) 8(-1.905,3.542)
SW-SMD_L5.4-W2.8-LS8.2
  rect 1x1.8 smd: 1(0,-3.493) 2(0,3.493)
TSSOP-28_L9.7-W4.4-P0.65-LS6.4-BL
  oval 0.343x1.732 smd: 1(-4.225,-2.866) 2(-3.575,-2.866) 3(-2.925,-2.866) 4(-2.275,-2.866) 5(-1.625,-2.866) 6(-0.975,-2.866) 7(-0.325,-2.866) 8(0.325,-2.866) 9(0.975,-2.866) 10(1.625,-2.866) 11(2.275,-2.866) 12(2.925,-2.866) 13(3.575,-2.866) 14(4.225,-2.866) 15(4.225,2.866) 16(3.575,2.866) 17(2.925,2.866) 18(2.275,2.866) 19(1.625,2.866) 20(0.975,2.866) 21(0.325,2.866) 22(-0.325,2.866) 23(-0.975,2.866) 24(-1.625,2.866) 25(-2.275,2.866) 26(-2.925,2.866) 27(-3.575,2.866) 28(-4.225,2.866)
USB-SMD_TYPE-C16PIN
  oval 1.25x2.4 hole 0.65x1.7: 17(-4.325,1.835) 18(4.325,1.835)
  oval 1.4x2.1 hole 0.65x1.4: 19(-4.325,-2.365) 20(4.325,-2.365)
  rect 0.3x1.15 smd: A1(-3.35,2.365) A4(-2.55,2.365) A5(-1.25,2.365) A6(-0.25,2.365) A7(0.25,2.365) A8(1.25,2.365) A9(2.55,2.365) A12(3.35,2.365) B1(3.05,2.365) B4(2.25,2.365) B5(1.75,2.365) B6(0.75,2.365) B7(-0.75,2.365) B8(-1.75,2.365) B9(-2.25,2.365) B12(-3.05,2.365)
WSON-8_L2.0-W2.0-P0.65-BL-EP
  rect 0.28x0.505 smd: 1(-0.75,-0.927) 2(-0.25,-0.927) 3(0.25,-0.927) 4(0.75,-0.927) 5(0.75,0.927) 6(0.25,0.927) 7(-0.25,0.927) 8(-0.75,0.927)
  rect 1.6x0.9 smd: 9(0,0)
WSON-12_L3.0-W2.0-P0.50-BL-EP
  rect 0.28x0.5 smd: 1(-1.25,-0.94) 2(-0.75,-0.94) 3(-0.25,-0.94) 4(0.25,-0.94) 5(0.75,-0.94) 6(1.25,-0.94) 7(1.25,0.94) 8(0.75,0.94) 9(0.25,0.94) 10(-0.25,0.94) 11(-0.75,0.94) 12(-1.25,0.94)
  custom 3.4x0.9 smd: 13(0,0)

## Nets
+3V: C40.2 C41.2 C42.2 C43.2 R25.2 U9.11 U13.8 U14.8
-3V: C46.1 C47.1 C48.1 C49.1 R26.2 U9.6 U13.4 U14.4
GND: 5V.4 12MHz.2 12MHz.4 BOOT1.3 BOOT1.4 C1.2 C2.2 C3.2 C4.2 C5.2 C7.1 C8.1 C9.1 C10.1 C11.2 C12.1 C13.1 C14.1 C16.2 C17.1 C18.1 C19.1 C20.1 C21.1 C30.1 C31.1 C32.1 C33.1 C34.1 C35.1 C36.1 C38.1 C39.2 C40.1 C41.1 C42.1 C43.1 C45.1 C46.2 C47.2 C48.2 C49.2 C53.1 C54.1 C55.1 C56.1 NOREF.1 NOREF#2.1 NOREF#3.1 NOREF#4.1 OUTA.1 OUTA.2 OUTA.3 OUTA.4 OUTB.1 OUTB.2 OUTB.3 OUTB.4 R3.2 R4.2 R5.2 R8.1 R9.1 R10.2 R12.2 R13.2 R21.2 R24.1 R27.1 R28.1 R29.1 R32.2 R49.1 REST.3 REST.4 RP2040.19 RP2040.57 U1.16 U1.20 U1.26 U5.16 U5.20 U5.26 U9.4 U9.13 U10.4 U11.17 U11.18 U11.19 U11.20 U11.A1 U11.A12 U11.B1 U11.B12 U19.1 U19.3 U19.9
VDD: C20.2 C21.2 C30.2 C31.2 C32.2 C33.2 C34.2 C35.2 C36.2 C39.1 C52.2 C53.2 C54.2 L6.1 LED.2 PWR.2 R23.2 R48.2 RP2040.1 RP2040.10 RP2040.22 RP2040.33 RP2040.42 RP2040.43 RP2040.44 RP2040.48 RP2040.49 U1.27 U5.27 U9.3 U9.8 U9.12 U10.8 U20.1
VDDA: C18.2 C19.2 L6.2 U1.24 U5.24
CLKA: RP2040.17 U1.28
CLKB: RP2040.40 U5.28
DA0: RP2040.4 U1.12
DA1: RP2040.5 U1.11
DA2: RP2040.6 U1.10
DA3: RP2040.7 U1.9
DA4: RP2040.8 U1.8
DA5: RP2040.9 U1.7
DA6: RP2040.11 U1.6
DA7: RP2040.12 U1.5
DA8: RP2040.13 U1.4
DA9: RP2040.14 U1.3
DA10: RP2040.15 U1.2
DA11: RP2040.16 U1.1
DB0: RP2040.27 U5.12
DB1: RP2040.28 U5.11
DB2: RP2040.29 U5.10
DB3: RP2040.30 U5.9
DB4: RP2040.31 U5.8
DB5: RP2040.32 U5.7
DB6: RP2040.34 U5.6
DB7: RP2040.35 U5.5
DB8: RP2040.36 U5.4
DB9: RP2040.37 U5.3
DB10: RP2040.38 U5.2
DB11: RP2040.39 U5.1
FB+: R25.1 R27.2 U9.2
FB-: R26.1 R28.2 U9.7
IOUTA: R7.1 R8.2 U1.22
IOUTB: R9.2 R11.1 U5.22
LED: R20.2 RP2040.41
QSPI_CLK: RP2040.52 U10.6
QSPI_CS: R22.2 R23.1 RP2040.56 U10.1
QSPI_D0: RP2040.53 U10.5
QSPI_D1: RP2040.55 U10.2
QSPI_D2: RP2040.54 U10.3
QSPI_D3: RP2040.51 U10.7
REST: REST.1 RP2040.26
RX0: 5V.3 RP2040.3
TX0: 5V.2 RP2040.2
USB_DM: R30.2 RP2040.46
USB_DP: R31.2 RP2040.47
VS: 5V.1 C55.2 C56.2 D1.1 U19.5 U19.6 U19.7 U19.8
$1N1216: D1.2 U11.A4 U11.A9 U11.B4 U11.B9
$1N1218: R31.1 U11.A6 U11.B6
$1N1219: R30.1 U11.A7 U11.B7
$1N1223: R29.2 U11.A5
$1N1225: R32.1 U11.B5
$1N1377: 12MHz.1 C17.2 R15.1
$1N1386: 12MHz.3 C10.2 RP2040.20
$1N2002: C1.1 C2.1 C3.1 RP2040.23 RP2040.45 RP2040.50
$1N3144: R15.2 RP2040.21
$1N3422: C38.2 REST.2
$1N4540: C5.1 U1.23
$1N4544: C16.1 U5.23
$1N4675: R4.1 U1.21
$1N4699: R12.1 U5.21
$1N4854: R10.1 U5.18
$1N4906: C11.1 U5.17
$1N4979: R3.1 U1.18
$1N5031: C4.1 U1.17
$1N6731: C45.2 U9.5
$1N6733: C44.2 U9.10
$1N6734: C44.1 U9.9
$1N6742: R24.2 U9.1
$1N10979: R1.1 U13.2
$1N10982: C6.1 R1.2 U4.1 U13.1
$1N11756: C7.2 L1.1 R7.2
$1N11780: C8.2 L1.2 L2.1
$1N11804: C9.2 L2.2 U13.3
$1N12227: C6.2 R5.1 U4.2 U13.5
$1N12347: R2.1 U13.6
$1N12352: R2.2 R6.1 U13.7
$1N12806: R17.1 U14.2
$1N12810: C15.1 R17.2 U14.1 交/直流耦合.1
$1N12814: C12.2 L3.1 R11.2
$1N12817: C13.2 L3.2 L4.1
$1N12820: C14.2 L4.2 U14.3
$1N12832: C15.2 R13.1 U14.5 交/直流耦合.2
$1N12835: R16.1 U14.6
$1N12838: R14.1 R16.2 U14.7
$1N13071: OUTA.5 R6.2
$1N13189: OUTB.5 R14.2
$1N13340: LED.1 R20.1
$1N13552: PWR.1 R21.1
$1N19487: BOOT1.1 R22.1
$1N19944: U19.2 U20.2
$1N19945: C52.1 R48.1 R49.2 U19.4

Pads without a net: BOOT1 2; RP2040 18 24 25; U1 13 14 15 19 25; U5 13 14 15 19 25; U11 A8 B8

## Via types
v1: diameter 0.5, hole 0.3, Top Layer to Bottom Layer, 152 vias
v2: diameter 0.6, hole 0.3, Top Layer to Bottom Layer, 6 vias

## Routing (per net, layer and track width the routed paths; a pad name or vN(x,y) marks a point on that pad's centre or on a via; arc(x,y) is an arc through that point)
+3V: length 67
  Top Layer w0.254: C42.2 32.96,41.2 arc(32.99,41.21) U13.8 ; C43.2 9.08,41.4 U14.8
  Top Layer w0.4: 39.15,15.18 39.15,16.65 38.5,17.3 R25.2 ; 39.15,15.18 C40.2 ; 39.15,15.18 U9.11
  Top Layer w0.5: C43.2 7.6,42.2 v2(7.6,42.2) ; C42.2 31.52,41.22 v2(31.52,42.2)
  Bottom Layer w0.5: v2(39.15,16.42) 39.15,40.5 37.45,42.2 v2(31.52,42.2) 31.52,42.2 v2(7.6,42.2)
-3V: length 61.2
  Top Layer w0.254: U13.4 38.28,35.87 arc(38.29,35.86) C48.1 ; U14.4 14.38,36.02 arc(14.39,36.01) C49.1
  Top Layer w0.4: U9.6 32.68,13.18 32.4,12.9 32.4,11.85 32.75,11.5 v2(33.14,11.5) R26.2
  Top Layer w0.5: v2(15.25,36) C49.1 14.38,36.02 ; v2(38.3,35) C48.1
  Bottom Layer w0.5: v2(15.25,36) 37.3,36 v2(38.3,35) 38.3,23.95 36.95,22.6 36.95,12.4 36.05,11.5 v2(33.14,11.5)
GND: length 3
  Top Layer w0.15: 7.95,6.14 7.65,6.14 ; v1(24.36,30.36) 24,30 RP2040.19
  Top Layer w0.6: 7.65,6.14 7.21,6.14 6.68,5.61
  vias: v1(3.36,45.36) v1(3.36,42.36) v1(3.36,39.36) v1(3.36,36.36) v1(3.36,33.36) v1(3.36,30.36) v1(3.36,18.36) v1(5.45,19.45) v1(5.5,21.3) v1(6.36,48.36) v1(6.71,42.36) v1(6.71,36.36) v1(6.71,33.36) v1(6.71,30.36) v1(7.21,44.01) v1(7.89,10.45) v1(8.75,20.75) v1(8.8,15.35) v1(8.82,14.7) v1(8.82,14.06) v1(9.09,27.52) v1(10.6,32.45) v1(12.3,37.64) v1(12.36,45.36) v1(13.24,33.65) v1(13.41,44.96) v1(13.5,10.45) v1(14.31,48.71) v1(14.84,33.8) v1(14.8,31.25) v1(15.36,30.36) v1(16.4,25.8) v1(16.46,19.28) v1(16.66,39.21) v1(16.81,31.11) v1(17.95,11.6) v1(18.36,48.36) v1(18.36,45.36) v1(18.95,19.15) v1(19.6,39.35) v1(20,37) v1(20.41,33.16) v1(21.36,48.36) v1(21.36,45.36) v1(21.43,38.65) v1(21.36,9.36) v1(21.69,37.1) v1(21.9,26.45) v1(21.9,25.49) v1(21.9,24.55) v1(23,25.49) v1(23,24.55) v1(23.25,18) v1(24.03,24.55) v1(24.36,48.36) v1(24.36,45.36) v1(24.36,33.36) v1(24.56,38.51) v1(25.71,33.26) v1(25.98,17.36) v1(26.26,30.86) v1(27.36,48.36) v1(27.36,45.36) v1(29.21,38.86) v1(29.3,20.3) v1(29.41,45.51) v1(30.35,30.79) v1(30.45,25.95) v1(30.86,34.01) v1(31.66,48.56) v1(31.69,9.14) v1(33,33.05) v1(33.36,39.36) v1(33.36,18.36) v1(34.69,9.14) v1(34.8,25.45) v1(35.92,23.17) v1(35.92,21.89) v1(35.92,20.32) v1(36,19.02) v1(36.03,15.2) v1(36.01,14.52) v1(36.03,13.81) v1(36.36,45.36) v1(36.65,32.34) v1(36.8,27.2) v1(36.8,26.21) v1(36.8,25.3) v1(37.69,9.14) v1(38.76,44.21) v1(39.36,48.36) v1(39.36,42.36) v1(39.36,9.36) v1(42.36,45.36) v1(42.36,42.36) v1(42.36,39.36) v1(42.36,36.36) v1(42.36,33.36) v1(42.36,30.36) v1(42.36,18.36) v1(42.36,15.36) v1(42.36,12.36) v1(42.36,9.36) v1(42.36,6.36)
VDD: length 183.8
  Top Layer w0.2: v1(38.22,12.83) 38.17,12.83 37.32,13.68 U9.8 ; C52.2 C54.2 ; v1(38.25,16) 37.93,15.68 U9.12
  Top Layer w0.25: RP2040.10 25.55,26.49 24.44,27.6 23.15,27.6 22.8,27.95 RP2040.22 ; RP2040.33 v1(20.44,26.49) 20.44,21.98 RP2040.43 RP2040.44 ; RP2040.49 RP2040.48 v1(22.4,20.74) 22.4,20.1 22.55,19.95
  Top Layer w0.254: RP2040.22 22.8,30 22.41,30.39 22.06,30.39 C33.2 ; 41.95,27.1 41.53,27.53 v1(41.16,27.53) U1.27 ; C34.2 17.71,26.49 RP2040.33 ; RP2040.10 28.29,26.49 C36.2 ; RP2040.42 19.45,22.01
  Top Layer w0.3: C30.2 19.7,19.95 v1(19.65,19.9) ; v1(38.22,12.83) 38.52,12.83 39.05,12.3 39.05,10.85 38.3,10.1 30.35,10.1 ; 10.72,18.22 10.74,18.2 R48.2 ; 4.05,19.15 4.05,11.3 PWR.2 ; C20.2 4.33,20.38 U5.27 ; 25.84,22.92 25.5,23.25 25.5,26.44 25.55,26.49 ; R23.2 21.14,11.89 19.85,11.89 19.85,13.15 U10.8 ; RP2040.43 v1(19.65,21.94) 19.52,21.94 19.45,22.01 19.45,21.8 C32.2 17.02,19.37 17.02,15.95 16.5,15.43 15.6,15.43 arc(15.39,15.35) L6.1
  Top Layer w0.4: v1(33.06,14.68) v1(33.69,14.68) U9.3 ; 26.91,22.74 27.3,22.35 C35.2 v1(27.3,19.8) ; 26.55,22.79 26.91,22.79 ; 19.85,11.89 19.9,11.84 v1(19.9,11.02) 19.42,10.55 LED.2 ; 26.53,22.81 25.89,22.81
  Top Layer w0.6: C20.2 4.05,19.15 4.98,18.22 13.23,18.22 13.49,17.96 C52.2 ; v1(29.75,12.35) v1(29.75,11.67) 29.75,10.7 ; 29.75,10.7 30.35,10.1 ; 29.75,10.7 29.75,6.1 v1(29.95,5.9) v1(30.55,5.9)
  Bottom Layer w0.2: v1(38.25,16) 38.22,15.97 v1(38.22,12.83)
  Bottom Layer w0.3: v1(19.65,19.9) 19.65,21.94 v1(19.65,21.94)
  Bottom Layer w0.4: 19.86,13.27 19.9,13.23 v1(19.9,11.02) ; 35.75,5.9 37.65,5.9 40.3,8.55 40.3,26.66 v1(41.16,27.53)
  Bottom Layer w0.6: 22.58,13.27 v1(29.95,5.9) v1(30.55,5.9) 35.75,5.9 ; v1(33.69,14.68) v1(33.06,14.68) 31.48,14.68 29.75,12.95 v1(29.75,12.35) v1(29.75,11.67)
  Bottom Layer w0.8: v1(22.4,20.74) 22.4,19.35 21.45,18.4 19.75,18.4 19.18,17.83 19.18,13.33 19.24,13.27 25.22,13.27 27.3,15.35 v1(27.3,19.8)
  Bottom Layer w1: 15.08,13.34 19.19,13.34 arc(19.21,13.34) 19.21,13.32
  vias: v1(14.51,13.66) v1(14.51,13) v1(15.23,13.66) v1(15.22,12.97)
VDDA: length 95.5
  Top Layer w0.254: 41.95,26.05 41.47,25.58 v1(41.15,25.58) U1.24 ; U5.24 4.47,22.33 4.05,21.91
  Top Layer w0.4: L6.2 15.3,17.95 14.2,19.05 v1(11.25,19.05) 11.25,20.25 9.18,22.33 U5.24
  Bottom Layer w0.4: v1(11.25,19.05) 7.2,19.05 2.25,14.1 2.25,7.7 6.25,3.7 36.85,3.7 41.15,8 v1(41.15,25.58)
CLKA: length 16
  Top Layer w0.15: U1.28 36.77,28.17 ; v1(34.99,28.16) 34.5,28.65 32.02,28.65 30.36,30.31 25.21,30.31 24.8,29.91 24.8,29.05 24.8,29.04
  Bottom Layer w0.15: v1(36.76,28.17) 36.75,28.16 v1(34.99,28.16)
CLKB: length 14
  Top Layer w0.15: v1(9.4,19.75) 9.38,19.72 U5.28 ; v1(14.8,19.75) 18.74,23.69 RP2040.40
  Bottom Layer w0.15: v1(14.8,19.75) 14.79,19.75 v1(9.4,19.75)
DA0: length 7.9
  Top Layer w0.15: RP2040.4 28.26,24.09 31.32,21.03 U1.12
DA1: length 7.8
  Top Layer w0.15: U1.11 31.28,21.67 28.46,24.49 RP2040.5
DA2: length 7.6
  Top Layer w0.15: RP2040.6 28.71,24.89 31.28,22.33 U1.10
DA3: length 7.5
  Top Layer w0.15: RP2040.7 29.01,25.29 31.32,22.97 33.13,22.97
DA4: length 7.4
  Top Layer w0.15: RP2040.8 29.31,25.69 31.38,23.62 U1.8
DA5: length 7.3
  Top Layer w0.15: U1.7 31.45,24.28 29.63,26.09 RP2040.9
DA6: length 7.7
  Top Layer w0.15: RP2040.11 27.82,26.89 28.18,27.25 29.82,27.25 32.15,24.92 U1.6
DA7: length 7.6
  Top Layer w0.15: U1.5 32.18,25.58 30.1,27.65 28.05,27.65 27.69,27.29 RP2040.12
DA8: length 7.5
  Top Layer w0.15: RP2040.13 27.59,27.69 27.95,28.05 30.35,28.05 32.18,26.22 U1.4
DA9: length 7.4
  Top Layer w0.15: RP2040.14 27.44,28.09 27.8,28.45 30.55,28.45 32.12,26.88 U1.3
DA10: length 8.2
  Top Layer w0.15: RP2040.15 30.56,29.04 32.07,27.53 U1.2
DA11: length 9.3
  Top Layer w0.15: U1.1 33.11,28.15 31.96,28.15 30.29,29.82 25.35,29.82 25.2,29.67 RP2040.16
DB0: length 10.4
  Top Layer w0.15: U5.12 12.89,26.85 13.81,26.85 14.05,27.09 14.05,27.95 15.92,29.82 20.65,29.82 20.8,29.67 RP2040.27
DB1: length 9.4
  Top Layer w0.15: U5.11 14.18,26.22 14.5,26.55 14.5,27.8 15.74,29.04 RP2040.28
DB2: length 8.8
  Top Layer w0.15: RP2040.29 18.76,28.09 18.45,28.4 15.65,28.4 14.85,27.6 14.85,26.05 14.35,25.55 12.89,25.55 U5.10
DB3: length 9
  Top Layer w0.15: RP2040.30 18.51,27.69 18.15,28.05 15.85,28.05 15.2,27.4 15.2,25.7 14.4,24.9 12.89,24.9 U5.9
DB4: length 9.3
  Top Layer w0.15: RP2040.31 18.36,27.29 17.95,27.7 16,27.7 15.55,27.25 15.55,25.4 14.45,24.3 12.89,24.3 U5.8
DB5: length 9.5
  Top Layer w0.15: RP2040.32 18.21,26.89 17.75,27.35 16.2,27.35 15.92,27.07 15.92,25.12 14.43,23.62 U5.7
DB6: length 7.9
  Top Layer w0.15: RP2040.34 17.49,26.09 14.38,22.97 12.87,22.97
DB7: length 8
  Top Layer w0.15: U5.5 14.38,22.33 17.74,25.69 RP2040.35
DB8: length 8.1
  Top Layer w0.15: U5.4 14.32,21.67 17.94,25.29 RP2040.36
DB9: length 8.2
  Top Layer w0.15: RP2040.37 18.19,24.89 14.35,21.05 12.89,21.05 U5.3
DB10: length 8.3
  Top Layer w0.15: RP2040.38 18.34,24.49 14.2,20.35 12.89,20.35 U5.2
DB11: length 8.4
  Top Layer w0.15: U5.1 14.1,19.72 18.47,24.09 RP2040.39
FB+: length 6.7
  Top Layer w0.2: R25.1 v1(36.05,17.3) R27.2
  Top Layer w0.3: v1(33.6,15.6) 34.02,15.18 U9.2
  Bottom Layer w0.3: v1(36.05,17.3) 34.35,17.3 33.6,16.55 v1(33.6,15.6)
FB-: length 3.1
  Top Layer w0.2: R26.1 R28.2 36.97,11.77 U9.7
IOUTA: length 9.3
  Top Layer w0.254: R8.2 R7.1
  Top Layer w0.4: 35.95,29.75 35.95,25.11 arc(36.2,24.52) 36.79,24.28 U1.22
IOUTB: length 9.6
  Top Layer w0.254: R9.2 R11.1
  Top Layer w0.4: U5.22 8.36,23.62 arc(9.48,24.09) 9.95,25.22 9.95,29.75
LED: length 31.7
  Top Layer w0.15: v1(15.15,18.98) 16.77,20.6 16.77,21.13 18.92,23.29 RP2040.41
  Top Layer w0.2: v1(14.28,9.95) 14.3,9.95 R20.2
  Bottom Layer w0.2: v1(15.15,18.98) 14.42,18.25 7.35,18.25 5.65,16.55 5.65,11.98 7.68,9.95 13.71,9.95 13.71,9.95 v1(14.28,9.95)
QSPI_CLK: length 12.5
  Top Layer w0.15: RP2040.52 24,20.5 24.3,20.2 24.3,18.24 22.14,16.09 21.93,16.09 arc(21.82,16.13) 21.78,16.24 21.78,16.52 arc(21.63,16.67) 21.48,16.52 21.48,15.66 arc(21.33,15.51) 21.18,15.66 21.18,16.52 arc(21.03,16.67) 20.88,16.52 20.88,16.24 arc(20.84,16.13) 20.73,16.09 U10.6
QSPI_CS: length 17.7
  Top Layer w0.15: RP2040.56 26.44,21.94 26.68,21.71 26.68,19.64 29.4,16.92 29.4,14.9 28.05,13.55 U10.1
  Top Layer w0.3: U10.1 24.7,13.55 23.82,12.67 R22.2 R23.1
QSPI_D0: length 11.8
  Top Layer w0.15: RP2040.53 24.4,22.65 24.53,22.78 v1(24.53,23.5) ; U10.5 v1(21.2,17.36)
  Bottom Layer w0.15: v1(24.53,23.5) 23.5,23.5 23.16,23.16 23.16,18.81 21.71,17.36 v1(21.2,17.36)
QSPI_D1: length 12.5
  Top Layer w0.15: U10.2 27.92,14.82 28.07,14.97 28.07,15.14 arc(28.14,15.32) 28.32,15.39 28.6,15.39 arc(28.85,15.64) 28.6,15.89 28.32,15.89 arc(28.07,16.14) 28.32,16.39 28.6,16.39 arc(28.85,16.64) 28.6,16.89 28.32,16.89 arc(28.14,16.96) 28.07,17.14 28.07,17.63 27.6,18.1 26.75,18.1 26.15,18.7 26.15,20.14 25.2,21.09 RP2040.55
QSPI_D2: length 12.5
  Top Layer w0.15: U10.3 24.96,16.09 24.8,16.25 24.8,16.64 arc(24.73,16.81) 24.56,16.88 arc(24.38,16.95) 24.31,17.13 24.31,17.14 arc(24.38,17.31) 24.56,17.38 arc(24.73,17.45) 24.8,17.63 24.8,18.14 arc(24.85,18.24) 24.95,18.29 25.53,18.29 arc(25.68,18.44) 25.53,18.59 24.95,18.59 arc(24.8,18.74) 24.95,18.89 25.53,18.89 arc(25.68,19.04) 25.53,19.19 24.95,19.19 arc(24.8,19.34) 24.95,19.49 25.53,19.49 arc(25.68,19.64) 25.53,19.79 24.95,19.79 arc(24.85,19.83) 24.8,19.94 24.8,19.94 24.8,20.7 24.8,20.7 RP2040.54
QSPI_D3: length 12.5
  Top Layer w0.15: U10.7 v1(21.15,14.82) ; RP2040.51 23.6,22.7 23.88,22.98 v1(24.05,22.98)
  Bottom Layer w0.15: v1(24.05,22.98) 24.1,22.93 24.1,17.57 21.35,14.82 v1(21.15,14.82)
REST: length 36.3
  Top Layer w0.15: 21.21,29.06 21.21,27.96 v1(21.2,27.95)
  Top Layer w0.3: v1(34.8,6.85) 34.8,3.93 36.22,2.5
  Bottom Layer w0.2: 21.2,25.8 21.2,27.95 v1(21.2,27.95) ; v1(34.8,6.85) 33.55,8.1 31.6,8.1 28.61,11.09 28.61,20.35 28.61,20.51 25.12,24 24.32,24 24.12,23.8 21.51,23.8 21.19,24.12 21.19,25.8
RX0: length 22.4
  Top Layer w0.15: RP2040.3 28.01,23.69 30.3,21.4 30.3,14.05 24.27,8.02 5V.3
TX0: length 22.6
  Top Layer w0.15: 5V.2 29.95,14.43 29.95,21.15 27.81,23.29 RP2040.2
USB_DM: length 19.7
  Top Layer w0.15: R30.2 10.95,10.45 11.45,10.95 11.45,11.65 11.85,12.05 16.7,12.05 17.62,12.97 17.62,18.92 19.85,21.15 21.45,21.15 21.6,21.3 RP2040.46
USB_DP: length 19.7
  Top Layer w0.15: R31.2 11.7,10.95 11.7,11.55 11.95,11.8 16.8,11.8 17.87,12.87 17.87,18.81 19.95,20.9 21.55,20.9 22,21.34 RP2040.47
VS: length 16.4
  Bottom Layer w1: 6.35,12.75 6.83,12.75 7.88,11.7 15.1,11.7 19.19,7.61 5V.1
  vias: v1(6.3,13.05) v1(6.3,12.45) v1(7.01,13.05) v1(7,12.45)
$1N1216: length 7
  Bottom Layer w1: v1(13.6,7.4) v1(13.6,8.05) 7.94,8.05 v1(7.89,8) v1(7.89,7.37)
$1N1218: length 6.7
  Top Layer w0.2: 10.75,6.14 10.75,5.1 arc(10.85,4.85) 11.1,4.75 11.35,4.75 arc(11.63,4.87) 11.75,5.15 11.75,8.7 R31.1
$1N1219: length 5.3
  Top Layer w0.2: 11.25,7.29 11.25,8.8 R30.1 ; 11.25,7.29 11.25,6.14 ; 11.25,7.29 arc(11.23,7.33) 11.19,7.35 10.55,7.35 arc(10.34,7.26) 10.25,7.05 10.25,6.14
$1N1223: length 3.1
  Top Layer w0.2: 9.75,6.14 9.75,9 R29.2
$1N1225: length 3.3
  Top Layer w0.2: 12.75,6.14 12.75,8.4 R32.1
$1N1377: length 4.3
  Top Layer w0.15: C17.2 20.52,34.28 21.97,34.28 21.97,33.38 23,32.35
$1N1386: length 9.7
  Top Layer w0.15: RP2040.20 23.6,33 23.07,33.53 23.07,35.38 23.68,35.98 25.57,35.98 25.85,35.7
$1N2002: length 19.3
  Top Layer w0.2: 20.55,30.85 21.45,29.95 22.1,29.95 22.4,29.65 RP2040.23
  Top Layer w0.25: v1(21.5,20.42) 21.5,20.1 C3.1 ; RP2040.45 21.2,22.7 v1(21.48,22.97) ; v1(21.48,22.97) 22.85,22.97 23.2,22.62 RP2040.50 23.2,20.35 C2.1 ; v1(21.48,22.97) 21.38,22.97 21,23.35 21,27.08 21.25,27.33 22.14,27.33 22.4,27.6 RP2040.23
  Bottom Layer w0.25: v1(21.5,20.42) 21.5,22.95 v1(21.48,22.97)
$1N3144: length 2.1
  Top Layer w0.15: 23,31.05 23.2,30.85 RP2040.21
$1N3422: length 1.4
  Top Layer w0.3: C38.2 36.22,7.38 36.22,6.7
$1N4540: length 3.1
  Top Layer w0.254: C5.1 41.88,24.92 U1.23
$1N4544: length 3.1
  Top Layer w0.254: 7.13,22.97 4.07,22.97 4.05,23
$1N4675: length 3
  Top Layer w0.254: U1.21 41.78,23.62 R4.1
$1N4699: length 3
  Top Layer w0.254: R12.1 4.18,24.28 U5.21
$1N4854: length 3.2
  Top Layer w0.254: R10.1 4.78,26.22 U5.18
$1N4906: length 3.1
  Top Layer w0.254: U5.17 7.11,26.9 4.05,26.9
$1N4979: length 3.3
  Top Layer w0.254: U1.18 41.12,21.67 R3.1
$1N5031: length 3.1
  Top Layer w0.254: U1.17 41.88,21.03 41.95,21.1
$1N6731: length 2.8
  Top Layer w0.2: 32.4,13.85 32.57,13.68 U9.5
$1N6733: length 3.8
  Top Layer w0.2: U9.10 37.47,14.68 38.25,13.9 38.74,13.9 38.75,13.9 39.55,13.9 39.56,13.9 39.75,13.9 40.25,13.4
$1N6734: length 2.5
  Top Layer w0.2: 39.15,13.4 38.3,13.4 37.52,14.18 U9.9
$1N6742: length 3.2
  Top Layer w0.3: R24.2 32.8,16.85 33.1,16.55 34.22,16.55 U9.1
$1N10979: length 2.8
  Top Layer w0.254: 34.26,35.87 34.26,35.03 arc(34.44,34.62) 34.85,34.45 arc(35.17,34.32) 35.3,34 R1.1
$1N10982: length 9
  Top Layer w0.254: U4.1 29.25,35.25 arc(29.91,36.84) C6.1 arc(32.56,37.06) 33,36 U13.1 33,34.66 arc(33.29,33.94) R1.2
$1N11756: length 3.2
  Top Layer w0.254: R7.2 C7.2 35.2,31.05
$1N11780: length 3.9
  Top Layer w0.254: L1.2 34.49,31.69 34.5,31.69 34.66,31.85 34.66,31.86 35.15,32.35 C8.2 35.35,32.35 L2.1
$1N11804: length 5.4
  Top Layer w0.254: C9.2 38.05,32.5 L2.2 arc(37.79,34.29) 37.15,34.55 36.3,34.55 arc(35.76,34.77) 35.53,35.31 U13.3
$1N12227: length 13.8
  Top Layer w0.254: R5.1 38.3,39.74 arc(37.86,40.79) U13.5 arc(36.09,39.51) 34.37,38.8 C6.2 arc(29.91,39.46) 29.25,41.05 U4.2
$1N12347: length 2.6
  Top Layer w0.254: R2.1 35.53,42.03 U13.6
$1N12352: length 3.4
  Top Layer w0.254: 34.26,41.23 34.26,43.23 arc(34.25,43.28) R6.1 R2.2
$1N12806: length 3
  Top Layer w0.254: 9.15,33.75 arc(9.57,33.93) 9.75,34.35 9.75,35.4 arc(9.93,35.84) U14.2
$1N12810: length 14.1
  Top Layer w0.254: 7.85,33.75 7.85,34.77 arc(8.21,35.65) U14.1 arc(9.79,37.7) 11.48,38.4 C15.1 arc(15.99,37.74) 16.65,36.15 交/直流耦合.1
$1N12814: length 3.3
  Top Layer w0.254: R11.2 9.25,31 L3.1 10.5,31.15 C12.2
$1N12817: length 3.8
  Top Layer w0.254: 10.55,33.75 10.55,33.7 C13.2 9.1,32.4 8.61,31.91 8.61,31.9 8.45,31.74 8.44,31.74 L3.2
$1N12820: length 3.8
  Top Layer w0.254: U14.3 11.63,34.06 arc(11.73,33.84) 11.95,33.75 11.95,32.5 C14.2
$1N12832: length 13
  Top Layer w0.254: R13.1 10.52,39 arc(12.21,39.7) U14.5 12.91,41.19 arc(13.34,40.14) C15.2 arc(15.99,40.36) 16.65,41.95 交/直流耦合.2
$1N12835: length 2.7
  Top Layer w0.254: R16.1 11.63,42.19 U14.6
$1N12838: length 3.4
  Top Layer w0.254: U14.7 10.37,43.48 arc(10.36,43.5) R14.1 R16.2
$1N13071: length 6.5
  Top Layer w0.254: OUTA.5 34.43,45.53 arc(34.27,45.16) 33.9,45 33.45,45 arc(33.06,44.84) 32.9,44.45 R6.2
$1N13189: length 7.2
  Top Layer w0.254: R14.2 9.05,44.35 arc(9.23,44.77) 9.65,44.95 10.85,44.95 arc(11.36,45.16) 11.57,45.67 OUTB.5
$1N13340: length 1.5
  Top Layer w0.3: R20.1 16.01,9.15 LED.1
$1N13552: length 1.5
  Top Layer w0.3: PWR.1 5.01,9.15 R21.1
$1N19487: length 15.2
  Top Layer w0.3: v1(27.52,10.6) 28.55,9.58 28.55,5.55 29.4,4.7 32.5,4.7 33.43,5.62 BOOT1.1 ; R22.1 v1(26.2,11.9)
  Bottom Layer w0.3: v1(27.52,10.6) 26.22,11.9 v1(26.2,11.9)
$1N19944: length 1.7
  Top Layer w0.45: U19.2 11.16,14.45 arc(11.3,14.51) U20.2
$1N19945: length 6.5
  Top Layer w0.2: U19.4 9.75,16.11 ; 9.75,16.11 11.21,16.11 arc(11.45,16.21) 11.55,16.45 11.55,16.71 arc(11.8,17.3) C52.1 ; 9.75,16.11 9.75,16.54 arc(9.66,16.76) R48.1 R49.2

## Copper pours and planes (outline as drawn; the poured copper is in the pictures)
GND on Top Layer: -2.6,53.15 48.35,53.15 48.35,-1.55 -2.6,-1.55
GND on Bottom Layer: -6.7,53.75 50.9,53.75 50.9,-3.4 -6.7,-3.4
VDD on Top Layer: 12.94,18 12.94,12.55 15.65,12.55 15.75,12.65 15.75,15.95 15.7,16 14.3,16 14.2,16.1 14.2,18
VDD on Bottom Layer: 14.16,14.28 15.6,14.28 15.6,12.6 14.16,12.6
VS on Top Layer: 5.9,15.6 8.22,15.6 8.22,11.7 5.9,11.7
$1N1216 on Top Layer: 13,8.3 14.15,8.3 14.15,5.57 13,5.57
$1N1216 on Top Layer: 7.2,9.45 8.95,9.45 8.95,5.57 7.2,5.57

Small or netless copper shapes (teardrops, artwork), in the pictures only: 270 on Top Layer, 36 on Bottom Layer

## Text on the board
Bottom Silkscreen Layer: JLCJLCJLCJLC
Top Silkscreen Layer: TX | RX | GND | AD9752 / 125M / 高速DAC / PIO驱动 | 交/直流耦合 | 自制DDS / 贰号机 / 量产型
